# EAGLE design MCU (EAGLE 7.2.0)
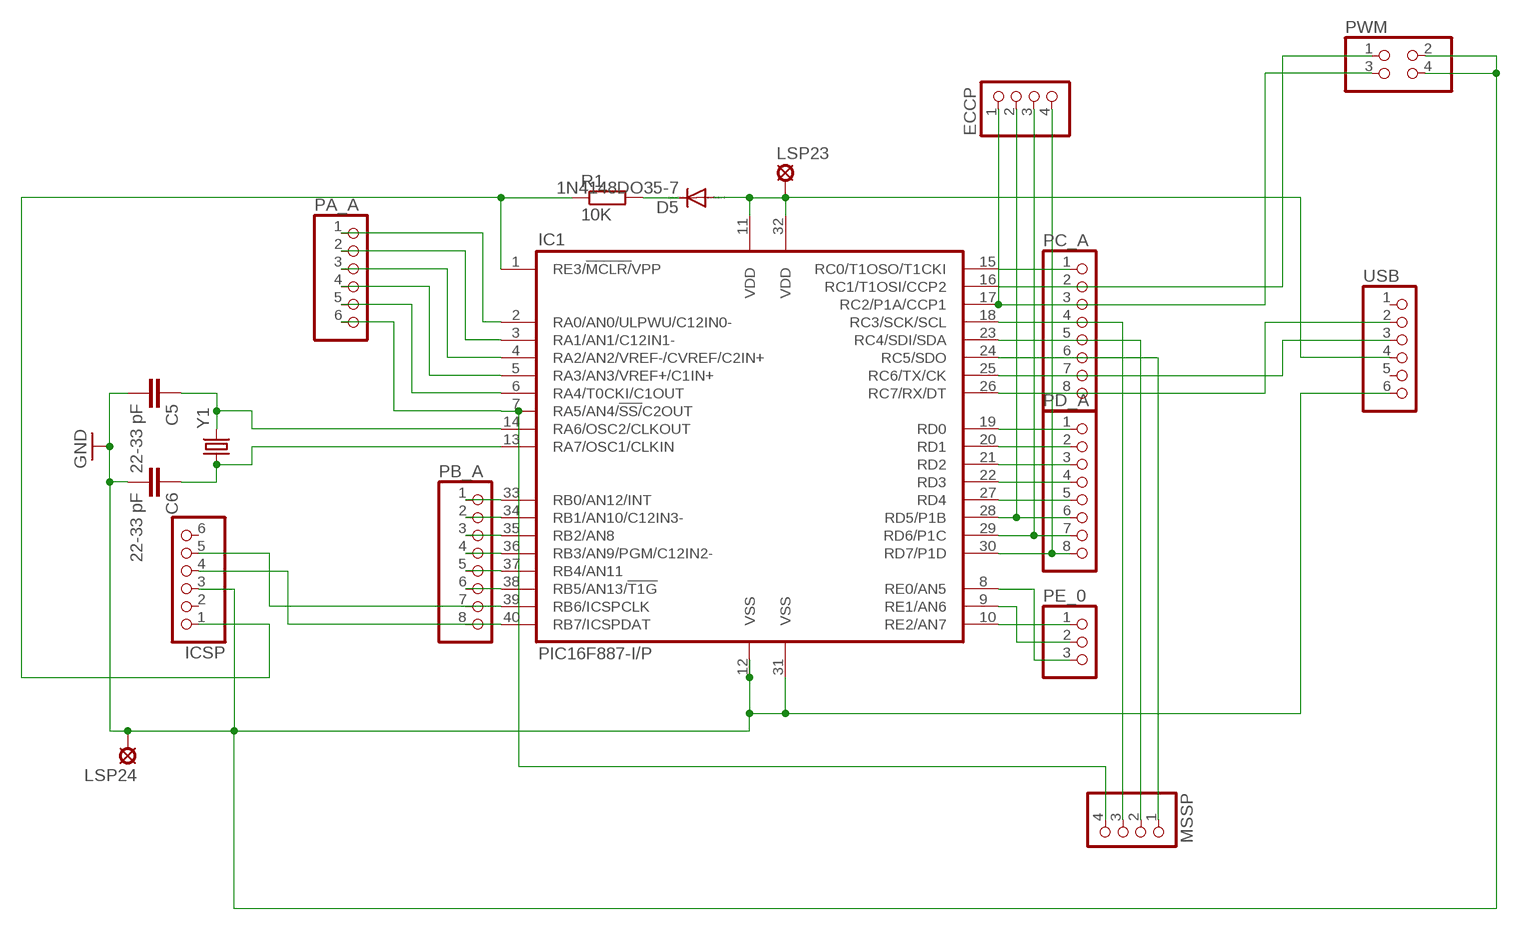
[diagram p0: schematic, sheet 1]

## Parts
C5  22-33 pF  C-EU025-024X044  [C025-024X044]
C6  22-33 pF  C-EU025-024X044  [C025-024X044]
D5  1N4148DO35-7  [DO35-7]
ECCP  PINHD-1X4  [1X04]
IC1  PIC16F887-I/P  [DIL40]
ICSP  PINHD-1X6  [1X06]
LSP23  LSP10  [LSP10]
LSP24  LSP10  [LSP10]
MSSP  PINHD-1X4  [1X04]
PA_A  PINHD-1X6  [1X06]
PB_A  PINHD-1X8  [1X08]
PC_A  PINHD-1X8  [1X08]
PD_A  PINHD-1X8  [1X08]
PE_0  PINHD-1X3  [1X03]
PWM  PINHD-2X2  [2X02]
R1  10K  R-EU_0207/10  [0207/10]
USB  PINHD-1X6  [1X06]
Y1  CRYSTALHC49UV  [HC49U-V]

## Nets
GND: C5.2 C6.2 IC1.12(VSS) IC1.31(VSS) ICSP.3 LSP24.MP PWM.2 PWM.4 USB.6
N$1: C5.1 IC1.14(RA6/OSC2/CLKOUT) Y1.2
N$3: IC1.15(RC0/T1OSO/T1CKI) PC_A.1
N$4: IC1.33(RB0/AN12/INT) PB_A.1
N$5: IC1.34(RB1/AN10/C12IN3-) PB_A.2
N$6: IC1.35(RB2/AN8) PB_A.3
N$7: IC1.36(RB3/AN9/PGM/C12IN2-) PB_A.4
N$8: IC1.2(RA0/AN0/ULPWU/C12IN0-) PA_A.1
N$9: IC1.3(RA1/AN1/C12IN1-) PA_A.2
N$10: IC1.4(RA2/AN2/VREF-/CVREF/C2IN+) PA_A.3
N$11: IC1.5(RA3/AN3/VREF+/C1IN+) PA_A.4
N$12: IC1.6(RA4/T0CKI/C1OUT) PA_A.5
N$13: IC1.7(RA5/AN4/!SS/!C2OUT) MSSP.4 PA_A.6
N$15: IC1.1(RE3/!MCLR/!VPP) ICSP.1 R1.1
N$17: IC1.19(RD0) PD_A.1
N$18: IC1.37(RB4/AN11) PB_A.5
N$19: IC1.38(RB5/AN13/!T1G) PB_A.6
N$20: IC1.39(RB6/ICSPCLK) ICSP.5 PB_A.7
N$21: IC1.40(RB7/ICSPDAT) ICSP.4 PB_A.8
N$23: IC1.20(RD1) PD_A.2
N$24: IC1.16(RC1/T1OSI/CCP2) PC_A.2 PWM.1
N$25: C6.1 IC1.13(RA7/OSC1/CLKIN) Y1.1
N$27: IC1.18(RC3/SCK/SCL) MSSP.3 PC_A.4
N$28: IC1.23(RC4/SDI/SDA) MSSP.2 PC_A.5
N$29: IC1.24(RC5/SDO) MSSP.1 PC_A.6
N$30: IC1.25(RC6/TX/CK) PC_A.7 USB.3
N$31: IC1.26(RC7/RX/DT) PC_A.8 USB.2
N$32: IC1.21(RD2) PD_A.3
N$33: IC1.22(RD3) PD_A.4
N$34: IC1.27(RD4) PD_A.5
N$35: ECCP.2 IC1.28(RD5/P1B) PD_A.6
N$36: ECCP.3 IC1.29(RD6/P1C) PD_A.7
N$37: ECCP.4 IC1.30(RD7/P1D) PD_A.8
N$38: ECCP.1 IC1.17(RC2/P1A/CCP1) PC_A.3 PWM.3
N$108: IC1.9(RE1/AN6) PE_0.2
N$110: IC1.8(RE0/AN5) PE_0.3
N$111: IC1.10(RE2/AN7) PE_0.1
N$112: D5.C R1.2
N$130: D5.A IC1.11(VDD) IC1.32(VDD) LSP23.MP USB.4
Unconnected: ICSP.2 ICSP.6 USB.1 USB.5

## Library data of the parts
C5 C6 = rcl:C-EU: CAPACITOR, European symbol
D5 = diode:1N4148: DIODE high speed (Philips)
ECCP MSSP = pinhead:PINHD-1X4: PIN HEADER
IC1 = microchip-pic16f887:PIC16F887: The library has been designed by Richard Magdycz <https://www.facebook.com/groups/eaglecadsoftUK>
ICSP PA_A USB = pinhead:PINHD-1X6: PIN HEADER
LSP23 LSP24 = solpad:LSP10: SOLDER PAD drill 1.0 mm, distributor Buerklin, 12H555
PB_A PC_A PD_A = pinhead:PINHD-1X8: PIN HEADER
PE_0 = pinhead:PINHD-1X3: PIN HEADER
PWM = pinhead:PINHD-2X2: PIN HEADER
R1 = resistor:R-EU_: RESISTOR, European symbol
Y1 = SparkFun-FreqCtrl:CRYSTAL: Various standard crystals. Proven footprints.

## Board
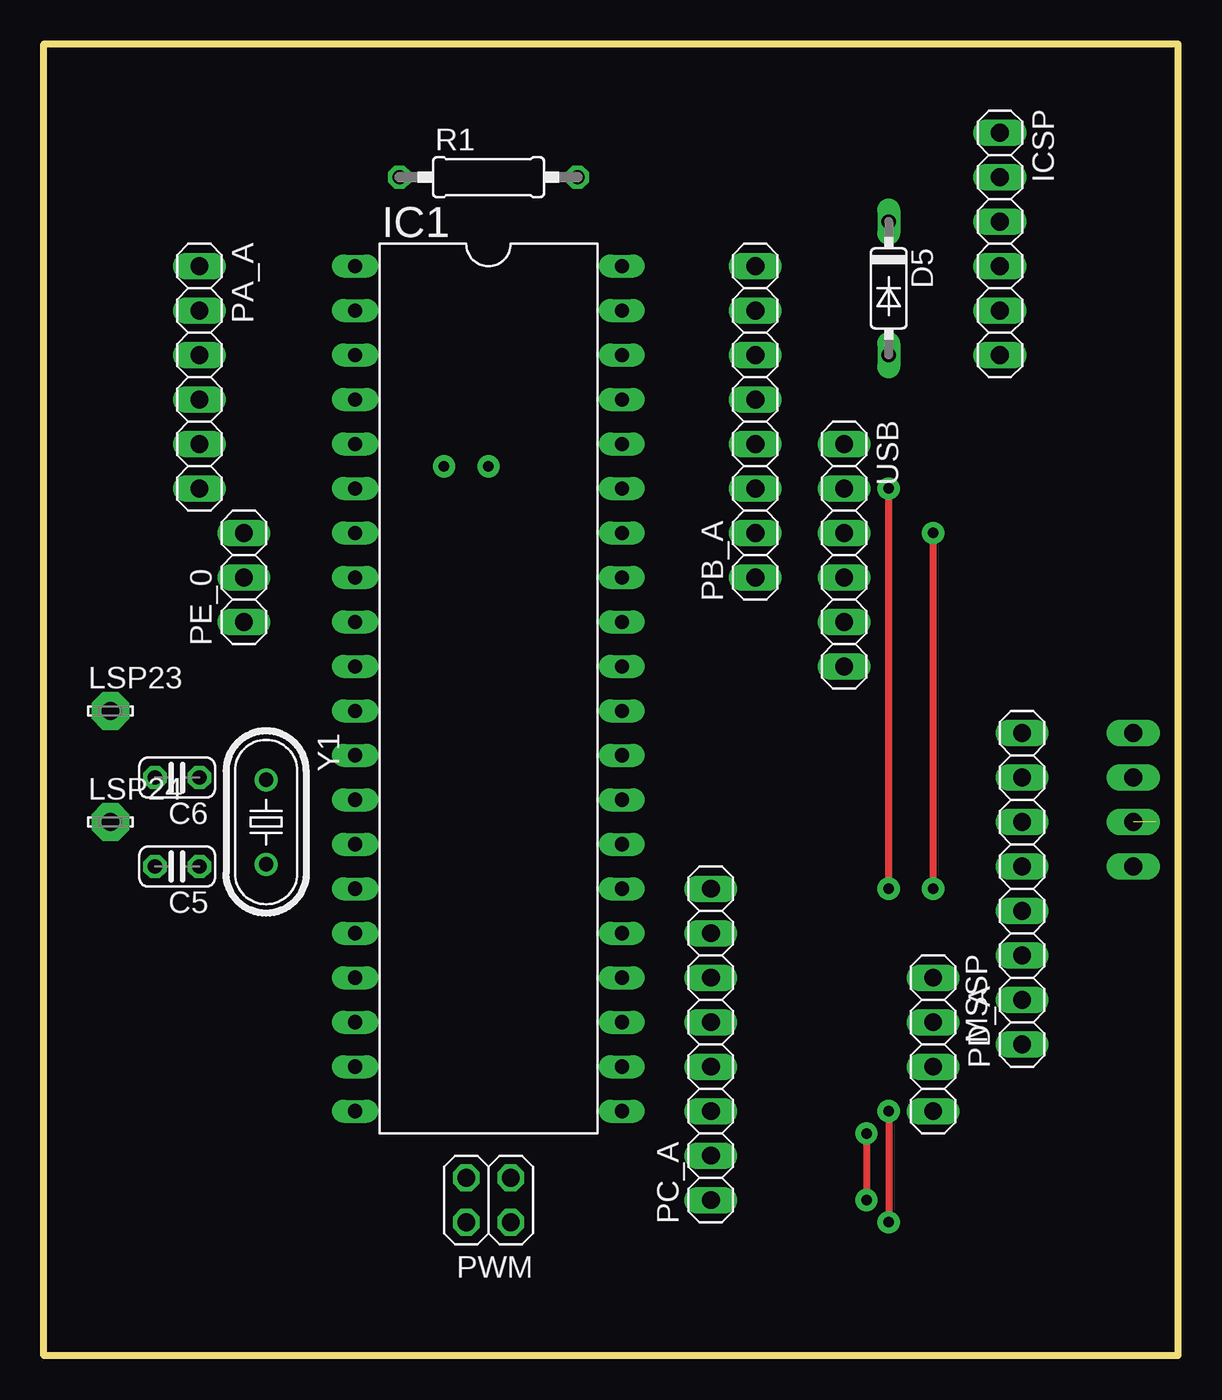
[diagram p1: board, top side]
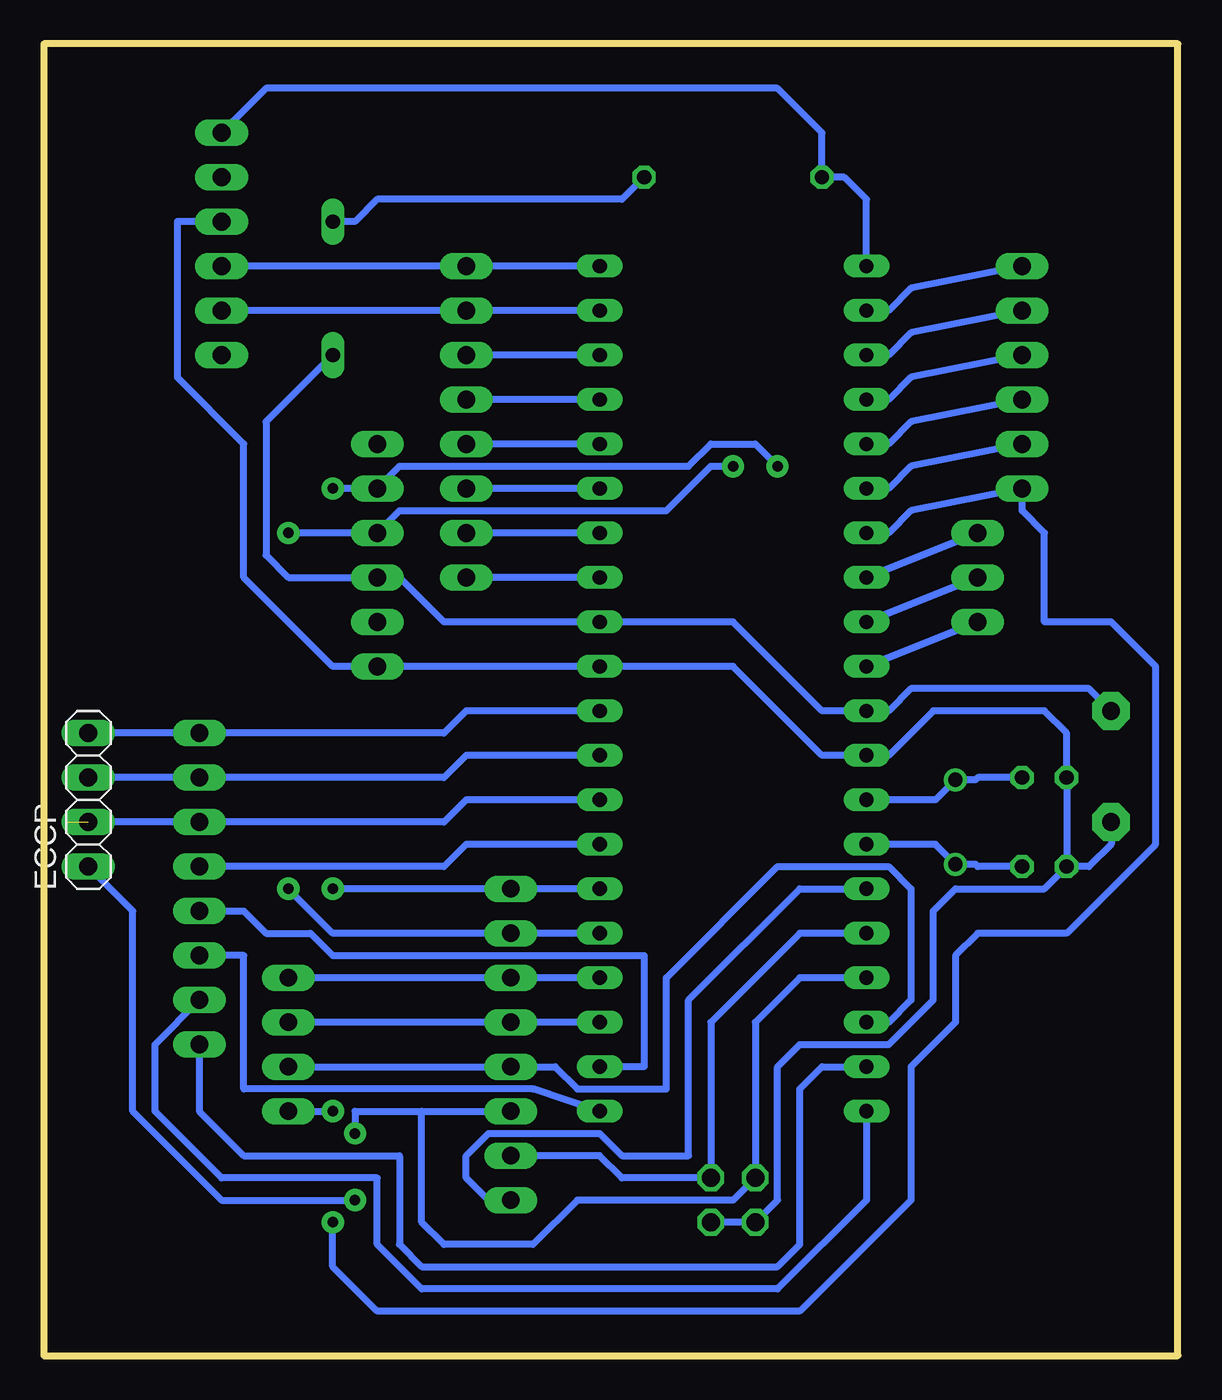
[diagram p2: board, bottom side, seen from below]

Size 64.77 x 74.93 mm. Coordinates in mm from the lower left corner, seen from the top.
Outline: 0,74.93 64.77,74.93 64.77,0 0,0 0,74.93
Copper layers (1*16): Top 0.035mm / dielectric 1.5mm / Bottom 0.035mm
Design rules "default": minimum track width 10mil, minimum drill 24mil, track to track 8mil, track to pad 8mil, pad to pad 8mil, via to via 8mil, smd to smd 8mil, copper to edge 40mil, drill to drill 8mil, minimum pad ring 10mil, minimum via ring 8mil, stop-mask expansion 4mil, vias tented up to drill 0mil, thermal gap 10mil

### Footprints (pad centres in the part's own frame; a part is rotated, then mirrored left to right if it is on the bottom)
C025-024X044 = drill 0.813 octagon: 1 -1.27,0; 2 1.27,0
DO35-7 = drill 0.813 long: A 3.81,0; C -3.81,0
1X04 = drill 1.016 long: 1 -3.81,0; 2 -1.27,0; 3 1.27,0; 4 3.81,0
DIL40 = drill 0.813 long: 1 -24.13,-7.62; 2 -21.59,-7.62; 3 -19.05,-7.62; 4 -16.51,-7.62; 5 -13.97,-7.62; 6 -11.43,-7.62; 7 -8.89,-7.62; 8 -6.35,-7.62; 9 -3.81,-7.62; 10 -1.27,-7.62; 11 1.27,-7.62; 12 3.81,-7.62; 13 6.35,-7.62; 14 8.89,-7.62; 15 11.43,-7.62; 16 13.97,-7.62; 17 16.51,-7.62; 18 19.05,-7.62; 19 21.59,-7.62; 20 24.13,-7.62; 21 24.13,7.62; 22 21.59,7.62; 23 19.05,7.62; 24 16.51,7.62; 25 13.97,7.62; 26 11.43,7.62; 27 8.89,7.62; 28 6.35,7.62; 29 3.81,7.62; 30 1.27,7.62; 31 -1.27,7.62; 32 -3.81,7.62; 33 -6.35,7.62; 34 -8.89,7.62; 35 -11.43,7.62; 36 -13.97,7.62; 37 -16.51,7.62; 38 -19.05,7.62; 39 -21.59,7.62; 40 -24.13,7.62
1X06 = drill 1.016 long: 1 -6.35,0; 2 -3.81,0; 3 -1.27,0; 4 1.27,0; 5 3.81,0; 6 6.35,0
LSP10 = drill 1.016 pad 2.159 octagon: MP 0,0
1X08 = drill 1.016 long: 1 -8.89,0; 2 -6.35,0; 3 -3.81,0; 4 -1.27,0; 5 1.27,0; 6 3.81,0; 7 6.35,0; 8 8.89,0
1X03 = drill 1.016 long: 1 -2.54,0; 2 0,0; 3 2.54,0
2X02 = drill 1.016 octagon: 1 -1.27,-1.27; 2 -1.27,1.27; 3 1.27,-1.27; 4 1.27,1.27
0207/10 = drill 0.813 octagon: 1 -5.08,0; 2 5.08,0
HC49U-V = drill 0.813: 1 -2.413,0; 2 2.413,0

### Placement (x,y rotation side)
C5  7.62,27.94 180 top
C6  7.62,33.02 180 top
D5  48.26,60.96 270 top
ECCP  62.23,31.75 90 bottom
IC1  25.4,38.1 270 top
ICSP  54.61,63.5 270 top
LSP23  3.81,36.83 0 top
LSP24  3.81,30.48 0 top
MSSP  50.8,17.78 270 top
PA_A  8.89,55.88 270 top
PB_A  40.64,53.34 90 top
PC_A  38.1,17.78 90 top
PD_A  55.88,26.67 90 top
PE_0  11.43,44.45 90 top
PWM  25.4,8.89 180 top
R1  25.4,67.31 0 top
USB  45.72,45.72 270 top
Y1  12.7,30.48 270 top

### Tracks (layer width: path | path; a pad name or v marks a point on that pad's centre or on a via)
GND
  Bottom 0.406: C5.2 C6.2 6.35,35.56 7.62,36.83 13.97,36.83 16.51,34.29 IC1.12 20.32,34.29 25.4,39.37 IC1.31 USB.6 48.26,39.37 53.34,44.45 53.34,52.07 57.15,55.88 57.15,64.77 ICSP.3 | PWM.2 PWM.4 22.86,8.89 22.86,16.51 21.59,17.78 16.51,17.78 13.97,20.32 13.97,25.4 12.7,26.67 7.62,26.67 C5.2 | LSP24.MP 3.81,29.21 5.08,27.94 C5.2
N$1
  Bottom 0.406: C5.1 11.43,27.94 11.56,28.07 Y1.2 13.84,29.21 IC1.14
N$3
  Bottom 0.406: PC_A.1 39.37,8.89 40.64,10.16 40.64,11.43 39.37,12.7 33.02,12.7 31.75,11.43 27.94,11.43 27.94,20.32 21.59,26.67 IC1.15
N$4
  Bottom 0.406: IC1.33 PB_A.1
N$5
  Bottom 0.406: IC1.34 PB_A.2
N$6
  Bottom 0.406: IC1.35 PB_A.3
N$7
  Bottom 0.406: IC1.36 PB_A.4
N$8
  Bottom 0.406: PA_A.1 15.24,60.96 16.51,59.69 IC1.2
N$9
  Bottom 0.406: PA_A.2 15.24,58.42 16.51,57.15 IC1.3
N$10
  Bottom 0.406: PA_A.3 15.24,55.88 16.51,54.61 IC1.4
N$11
  Bottom 0.406: PA_A.4 15.24,53.34 16.51,52.07 IC1.5
N$12
  Bottom 0.406: PA_A.5 15.24,50.8 16.51,49.53 IC1.6
N$13  (via drill 0.6 pad 1.27)
  Top 0.406: v48.26,13.97 v48.26,7.62
  Bottom 0.406: IC1.7 16.51,46.99 15.24,48.26 PA_A.6 8.89,48.26 7.62,46.99 7.62,41.91 3.81,41.91 1.27,39.37 1.27,29.21 6.35,24.13 11.43,24.13 12.7,22.86 12.7,19.05 15.24,16.51 15.24,8.89 21.59,2.54 45.72,2.54 48.26,5.08 v48.26,7.62 | MSSP.4 v48.26,13.97
N$15
  Bottom 0.406: IC1.1 17.78,66.04 19.05,67.31 R1.1 20.32,69.85 22.86,72.39 52.07,72.39 ICSP.1
N$17
  Bottom 0.406: PD_A.1 55.88,13.97 53.34,11.43 44.45,11.43 44.45,6.35 43.18,5.08 22.86,5.08 21.59,6.35 21.59,15.24 20.32,16.51 IC1.19
N$18
  Bottom 0.406: IC1.37 PB_A.5
N$19
  Bottom 0.406: IC1.38 PB_A.6
N$20
  Bottom 0.406: IC1.39 PB_A.7 ICSP.5
N$21
  Bottom 0.406: IC1.40 PB_A.8 ICSP.4
N$23
  Bottom 0.406: PD_A.2 58.42,17.78 58.42,13.97 54.61,10.16 45.72,10.16 45.72,6.35 43.18,3.81 22.86,3.81 17.78,8.89 IC1.20
N$24
  Bottom 0.406: IC1.16 21.59,24.13 26.67,19.05 PWM.1 31.75,10.16 33.02,11.43 PC_A.2
N$25
  Bottom 0.406: C6.1 11.43,33.02 11.56,32.89 Y1.1 13.84,31.75 IC1.13
N$27
  Bottom 0.406: MSSP.3 PC_A.4 35.56,16.51 34.29,15.24 29.21,15.24 29.21,21.59 22.86,27.94 16.51,27.94 15.24,26.67 15.24,20.32 16.51,19.05 IC1.18
N$28
  Bottom 0.406: IC1.23 PC_A.5 MSSP.2
N$29
  Bottom 0.406: IC1.24 PC_A.6 MSSP.1
N$30  (via drill 0.6 pad 1.27)
  Top 0.406: v50.8,26.67 v50.8,46.99
  Bottom 0.406: IC1.25 PC_A.7 48.26,24.13 v50.8,26.67 | v25.4,50.8 26.67,50.8 29.21,48.26 44.45,48.26 USB.3 v50.8,46.99
N$31  (via drill 0.6 pad 1.27)
  Top 0.406: v48.26,26.67 v48.26,49.53
  Bottom 0.406: IC1.26 PC_A.8 v48.26,26.67 | v22.86,50.8 24.13,52.07 26.67,52.07 27.94,50.8 44.45,50.8 USB.2 v48.26,49.53
N$32
  Bottom 0.406: IC1.21 36.83,15.24 53.34,15.24 53.34,22.86 PD_A.3
N$33
  Bottom 0.406: PD_A.4 53.34,25.4 52.07,24.13 49.53,24.13 48.26,22.86 30.48,22.86 30.48,16.51 IC1.22
N$34
  Bottom 0.406: IC1.27 40.64,29.21 41.91,27.94 PD_A.5
N$35  (1 unrouted)
  Bottom 0.406: IC1.28 40.64,31.75 41.91,30.48 PD_A.6 63.5,30.48
N$36
  Bottom 0.406: IC1.29 40.64,34.29 41.91,33.02 PD_A.7 ECCP.3
N$37
  Bottom 0.406: IC1.30 40.64,36.83 41.91,35.56 PD_A.8 ECCP.4
N$38  (via drill 0.6 pad 1.27)
  Top 0.406: v46.99,12.7 v46.99,8.89
  Bottom 0.406: IC1.17 21.59,21.59 24.13,19.05 PWM.3 25.4,8.89 34.29,8.89 36.83,6.35 41.91,6.35 43.18,7.62 43.18,13.97 | 43.18,13.97 46.99,13.97 v46.99,12.7 | 43.18,13.97 PC_A.3 | ECCP.1 59.69,25.4 59.69,13.97 54.61,8.89 v46.99,8.89
N$108
  Bottom 0.406: PE_0.2 IC1.9
N$110
  Bottom 0.406: PE_0.3 IC1.8
N$111
  Bottom 0.406: PE_0.1 IC1.10
N$112
  Bottom 0.406: R1.2 31.75,66.04 45.72,66.04 46.99,64.77 D5.C
N$130
  Bottom 0.406: D5.A 52.07,53.34 52.07,45.72 50.8,44.45 USB.4 44.45,44.45 41.91,41.91 IC1.32 25.4,41.91 20.32,36.83 IC1.11 16.51,36.83 15.24,38.1 5.08,38.1 LSP23.MP